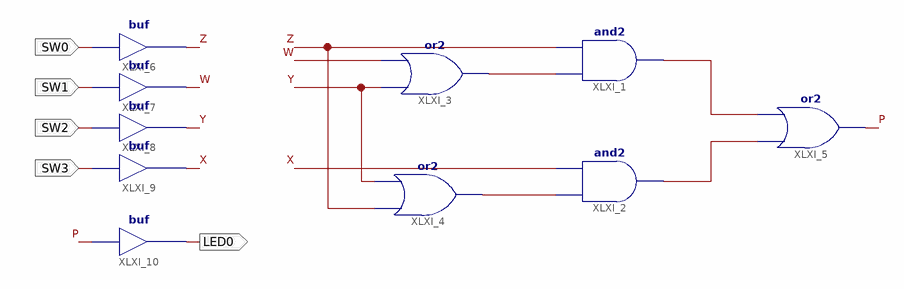
[diagram p0: schematic sheet 1]
// Xilinx ISE schematic Votecircuit1.sch (spartan3) as structural Verilog: 10 symbols, 5 ports
module Votecircuit1 (
  input  SW0,
  input  SW1,
  input  SW2,
  input  SW3,
  output LED0
);

  wire P, W, X, XLXN_1, XLXN_11, XLXN_17, XLXN_18, Y, Z;

  and XLXI_1 (XLXN_17, XLXN_1, Z);
  and XLXI_2 (XLXN_18, XLXN_11, X);
  or XLXI_3 (XLXN_1, Y, W);
  or XLXI_4 (XLXN_11, Z, Y);
  or XLXI_5 (P, XLXN_18, XLXN_17);
  buf XLXI_6 (Z, SW0);
  buf XLXI_7 (W, SW1);
  buf XLXI_8 (Y, SW2);
  buf XLXI_9 (X, SW3);
  buf XLXI_10 (LED0, P);
endmodule
